# EAGLE design 0225-carrier-humidity-sensor (EAGLE 9.6.2)
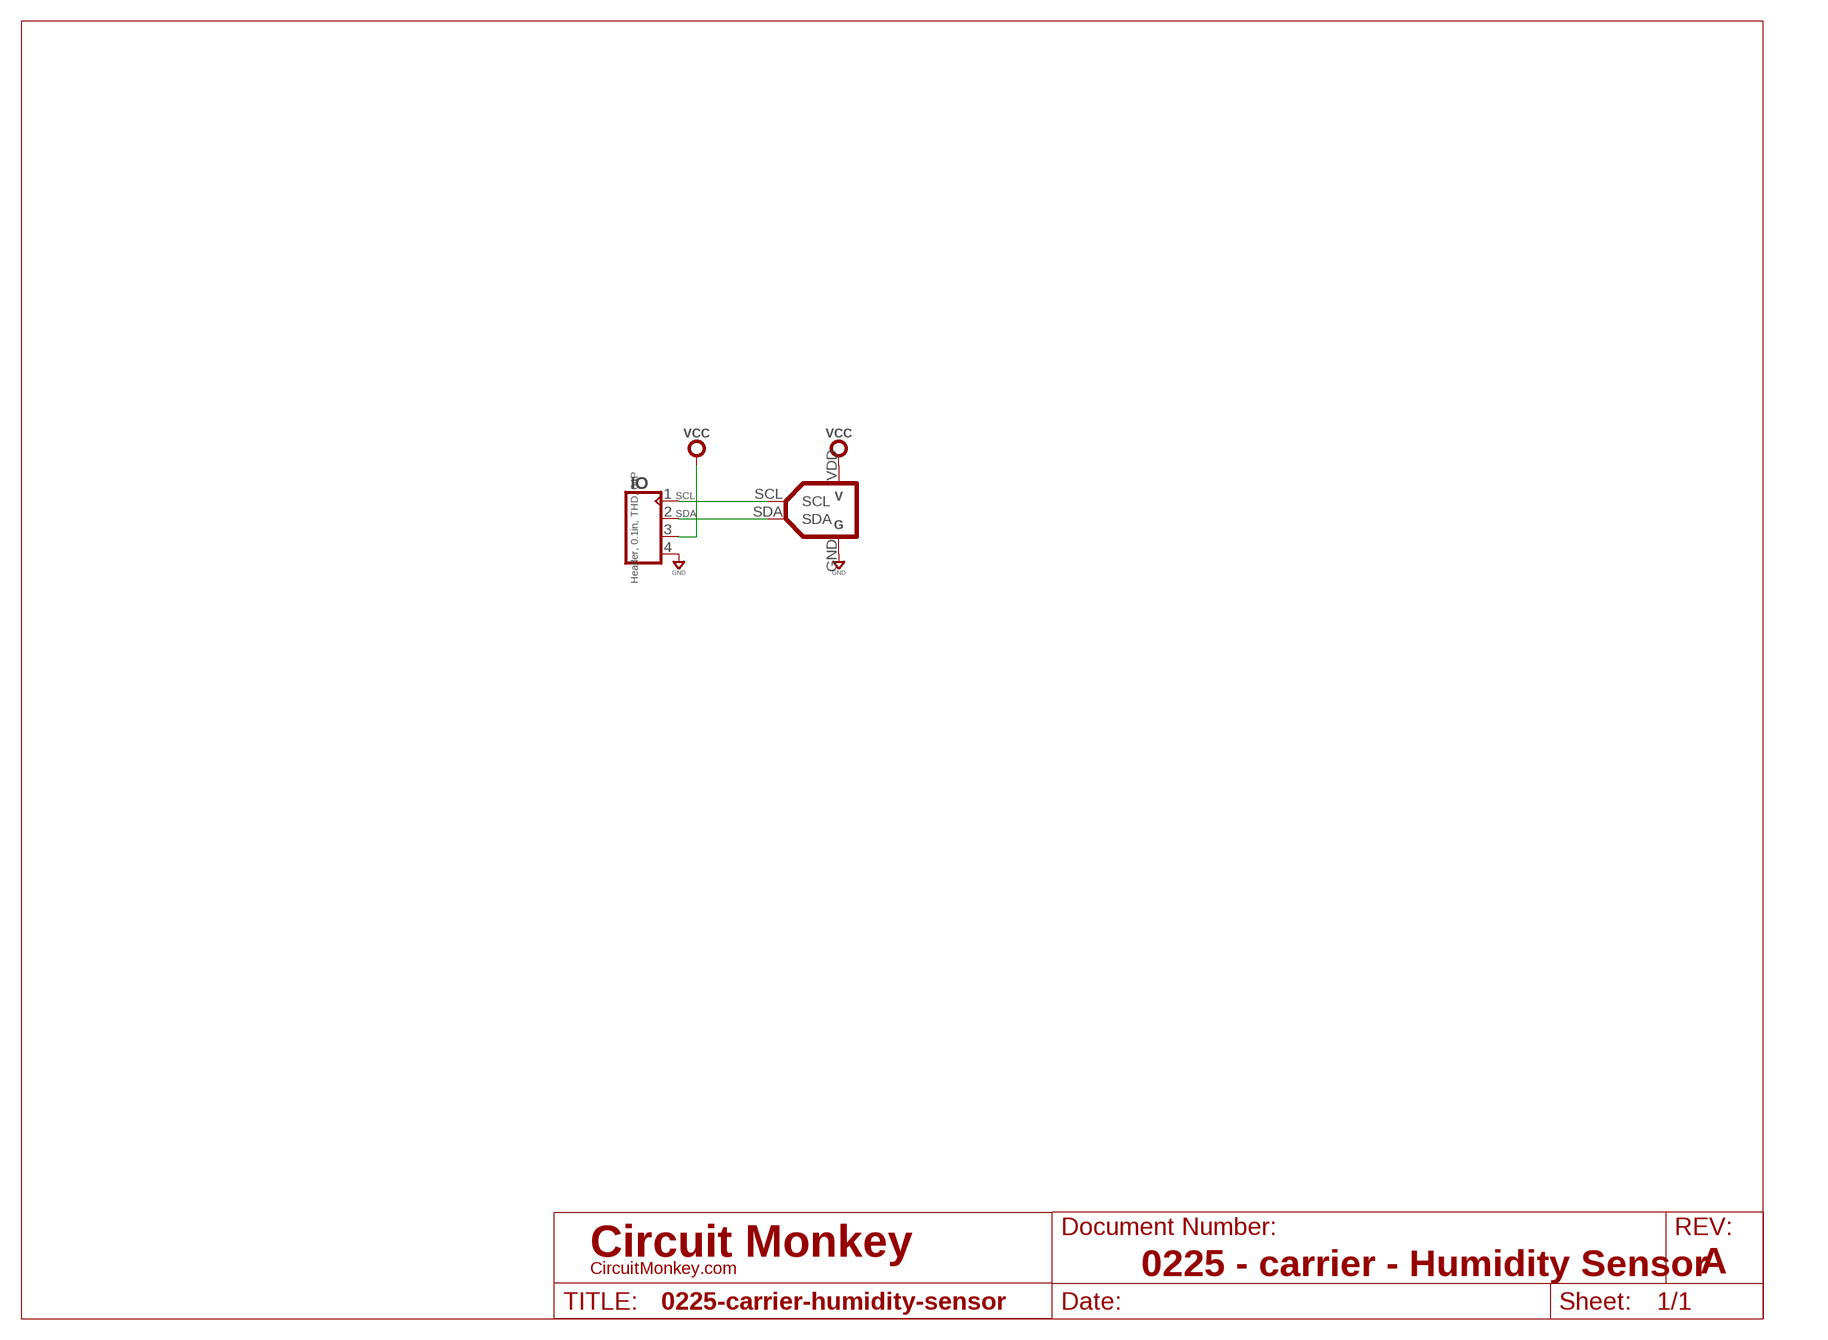
[diagram p0: schematic, sheet 1]
SHEET1 (LETTER_L-CIRCUITMONKEY): DOCUMENT_NUMBER: 0225 - carrier - Humidity Sensor; REV: A

## Parts
0125  0125REV-A  [0125A]
IO  Header, 0.1in, THD, 04P  CON_04X1-THD-VT  [MA04X1-VT-THD]

## Nets
GND: 0125.GND IO.4
SCL: 0125.SCL IO.1
SDA: 0125.SDA IO.2
VCC: 0125.VDD IO.3

## Library data of the parts
0125 = circuit-monkey-chips:0125: #0125 Humidity Sensor Module
IO = con-headers:CON_04X1: Headers, 04 pin; MFR: Molex; MPN: 022284043

## Board
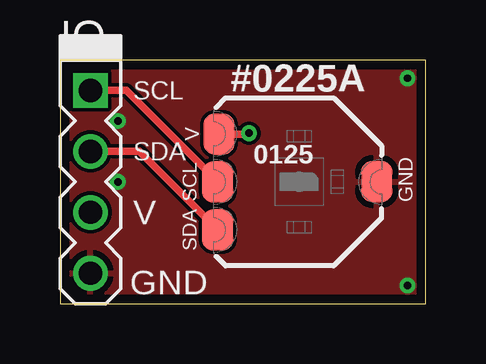
[diagram p1: board, top side]
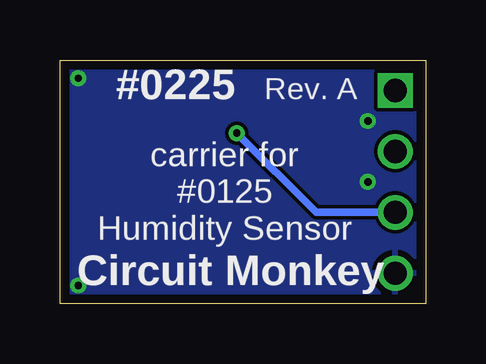
[diagram p2: board, bottom side, seen from below]

Size 15.24 x 10.16 mm. Coordinates in mm from the lower left corner, seen from the top.
Outline: 0,0 15.24,0 15.24,10.16 0,10.16 0,0
Copper layers (1*16): Top 0.0356mm / dielectric 1.5011mm / Bottom 0.0356mm
Design rules "OSH-CircuitMonkey": minimum track width 6mil, minimum drill 12mil, track to track 6mil, track to pad 6mil, pad to pad 6mil, via to via 6mil, smd to smd 6mil, copper to edge 15mil, drill to drill 6mil, minimum pad ring 7mil, minimum via ring 7mil, stop-mask expansion 3mil, vias tented up to drill 13mil, thermal gap 10mil

### Footprints (pad centres in the part's own frame; a part is rotated, then mirrored left to right if it is on the bottom)
0125A = smd 1.3 x 1.7: GND 3.29,0.01; SCL -3.34,0; SDA -3.34,-2; VDD -3.28,1.99
MA04X1-VT-THD = drill 0.965 square: 1 -3.81,0 | drill 0.965: 2 -1.27,0; 3 1.27,0; 4 3.81,0

### Placement (x,y rotation side)
0125  9.91,5.08 0 top
IO  1.27,5.08 270 top

### Tracks (layer width: path | path; a pad name or v marks a point on that pad's centre or on a via)
GND  (via drill 0.3)
  other vias: 2.41,7.62 2.41,5.08 14.48,9.4 14.48,0.76
  pour Top: 0,0 15.24,0 15.24,10.16 0,10.16
  pour Bottom: 15.24,0 0,0 0,10.16 15.24,10.16
SCL
  Top 0.305: IO.1 2.76,8.89 0125.SCL
SDA
  Top 0.305: IO.2 3.3,6.35 0125.SDA
VCC  (via drill 0.3)
  Top 0.305: v7.87,7.11 7.83,7.07 0125.VDD
  Bottom 0.305: IO.3 4.57,3.81 v7.87,7.11

### Text on the board
tPlace: SCL | #0225A | SDA | V | GND
bPlace: #0225 | Rev. A | carrier for / #0125 / Humidity Sensor | Circuit Monkey